# EAGLE schematic voltage (EAGLE 9.6.2)
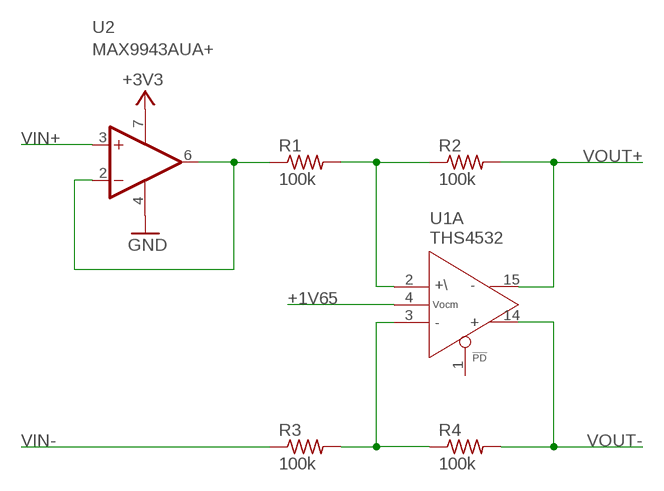
[diagram p0: schematic, sheet 1]

## Parts
R1  100k  R-US_R0805  [R0805]
R2  100k  R-US_R0805  [R0805]
R3  100k  R-US_R0805  [R0805]
R4  100k  R-US_R0805  [R0805]
U1  THS4532  [SOP65P640X120-16N]
U2  MAX9943AUA+  [SOP65P490X110-8N]

## Nets
+1V65: U1.4(A:VOCM)
+3V3: U2.7(V+)
GND: U2.4(V-)
N$1: R1.2 R2.1 U1.2(A:+IN)
N$2: R1.1 U2.2(-IN) U2.6(OUT)
N$3: R3.2 R4.1 U1.3(A:-IN)
VIN+: U2.3(+IN)
VIN-: R3.1
VOUT+: R2.2 U1.15(A:OUT-)
VOUT-: R4.2 U1.14(A:OUT+)
Unconnected: U1.1(A:!PD) U1.5(B:!PD) U1.6(B:+IN) U1.7(B:-IN) U1.8(B:VOCM) U1.10(B:OUT+) U1.11(B:OUT-)

## Power pins joined to a net without a drawn wire
V+: U1.9(C:V+) U1.13(C:V+)
V-: U1.12(C:V-) U1.16(C:V-)

## Library data of the parts
R1-R4 = rcl:R-US_: RESISTOR, American symbol; SPICEPREFIX: R
U1 = Soil Power Sensor:THS4532: Dual, Ultra low power 0.25mA, RRO, fully differential amplifier; AUTHOR: John Madden <jmadden173@pm.me>; DATE_CREATED: 2023-04-06; DATE_MODIFIED: 2023-04-06; MFC: TI; MPN: THS4532IPW; REF: https://www.ti.com/product/THS4532; SPICEPREFIX: X
U2 = Soil Power Sensor:MAX9943: High-Voltage, Precision, Low-Power Op Amps; AUTHOR: John Madden <jmadden173@pm.me>; DATE_CREATED: 2023-04-26; DATE_MODIFIED: 2023-04-26; MFC: Analog Devices; MPN: MAX9943AUA+T; REF: https://www.analog.com/en/products/MAX9943.html